# Altium project SVPXFMC_Carrier_6U.PrjPcb (part 5 of 9)

## Sheet DDR4 SDRAM.SchDoc
size A3
Used 2 times, as channels FMC Carrier Channel1/U_DDR4 SDRAM, FMC Carrier Channel2/U_DDR4 SDRAM. Parts and nets are listed once, with the designators drawn on the sheet.
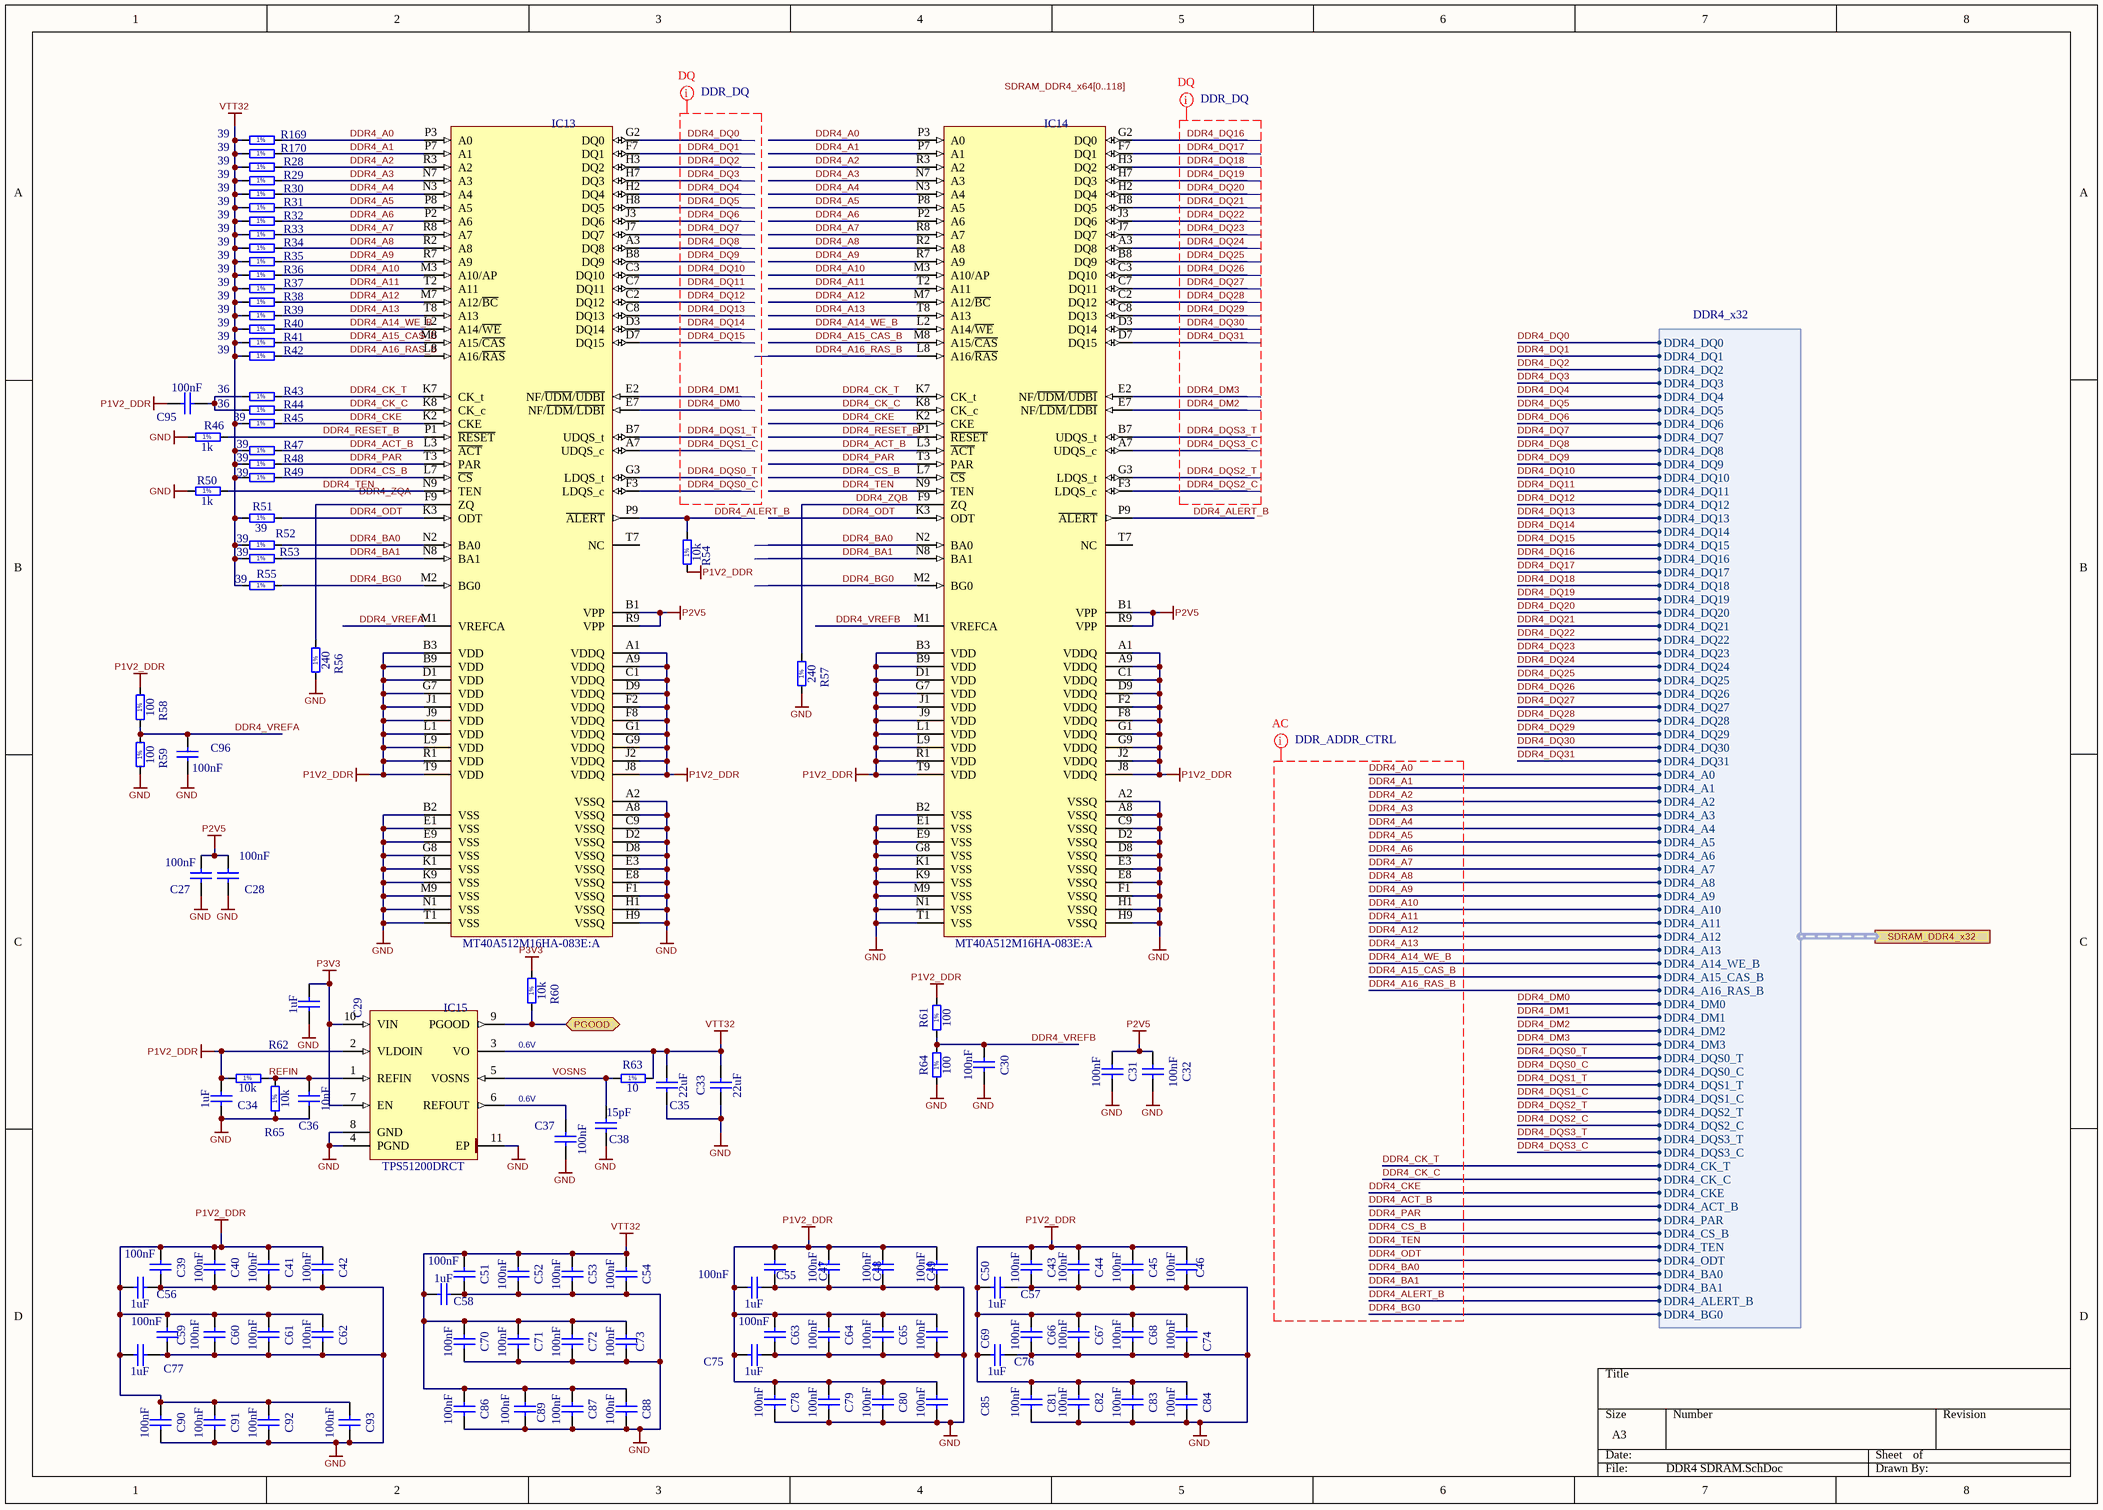
[diagram p13: DDR4 SDRAM.SchDoc]

### Parts
C27  100nF  [CAPC0603X33N]
C28  100nF  [CAPC0603X33N]
C29  1uF  [CAPC1005X55N]
C30  100nF  [CAPC0603X33N]
C31  100nF  [CAPC0603X33N]
C32  100nF  [CAPC0603X33N]
C33  22uF  [CAPC2012X135N]
C34  1uF  [CAPC1005X55N]
C35  22uF  [CAPC2012X135N]
C36  10nF  [CAPC1005X55N]
C37  100nF  [CAPC0603X33N]
C38  15pF  [CAPC1005X55N]
C39  100nF  [CAPC0603X33N]
C40  100nF  [CAPC0603X33N]
C41  100nF  [CAPC0603X33N]
C42  100nF  [CAPC0603X33N]
C43  100nF  [CAPC0603X33N]
C44  100nF  [CAPC0603X33N]
C45  100nF  [CAPC0603X33N]
C46  100nF  [CAPC0603X33N]
C47  100nF  [CAPC0603X33N]
C48  100nF  [CAPC0603X33N]
C49  100nF  [CAPC0603X33N]
C50  100nF  [CAPC0603X33N]
C51  100nF  [CAPC0603X33N]
C52  100nF  [CAPC0603X33N]
C53  100nF  [CAPC0603X33N]
C54  100nF  [CAPC0603X33N]
C55  1uF  [CAPC1005X55N]
C56  1uF  [CAPC1005X55N]
C57  1uF  [CAPC1005X55N]
C58  1uF  [CAPC1005X55N]
C59  100nF  [CAPC0603X33N]
C60  100nF  [CAPC0603X33N]
C61  100nF  [CAPC0603X33N]
C62  100nF  [CAPC0603X33N]
C63  100nF  [CAPC0603X33N]
C64  100nF  [CAPC0603X33N]
C65  100nF  [CAPC0603X33N]
C66  100nF  [CAPC0603X33N]
C67  100nF  [CAPC0603X33N]
C68  100nF  [CAPC0603X33N]
C69  100nF  [CAPC0603X33N]
C70  100nF  [CAPC0603X33N]
C71  100nF  [CAPC0603X33N]
C72  100nF  [CAPC0603X33N]
C73  100nF  [CAPC0603X33N]
C74  100nF  [CAPC0603X33N]
C75  1uF  [CAPC1005X55N]
C76  1uF  [CAPC1005X55N]
C77  1uF  [CAPC1005X55N]
C78  100nF  [CAPC0603X33N]
C79  100nF  [CAPC0603X33N]
C80  100nF  [CAPC0603X33N]
C81  100nF  [CAPC0603X33N]
C82  100nF  [CAPC0603X33N]
C83  100nF  [CAPC0603X33N]
C84  100nF  [CAPC0603X33N]
C85  100nF  [CAPC0603X33N]
C86  100nF  [CAPC0603X33N]
C87  100nF  [CAPC0603X33N]
C88  100nF  [CAPC0603X33N]
C89  100nF  [CAPC0603X33N]
C90  100nF  [CAPC0603X33N]
C91  100nF  [CAPC0603X33N]
C92  100nF  [CAPC0603X33N]
C93  100nF  [CAPC0603X33N]
C95  100nF  [CAPC0603X33N]
C96  100nF  [CAPC0603X33N]
IC13  MT40A512M16HA-083E:A  [BGA96C80P9X16_900X1400X120]
IC14  MT40A512M16HA-083E:A  [BGA96C80P9X16_900X1400X120]
IC15  TPS51200DRCT  [TEXAS_DRC (S-PVSON-N10)]
R28  39  [RESC1005X40N]
R29  39  [RESC1005X40N]
R30  39  [RESC1005X40N]
R31  39  [RESC1005X40N]
R32  39  [RESC1005X40N]
R33  39  [RESC1005X40N]
R34  39  [RESC1005X40N]
R35  39  [RESC1005X40N]
R36  39  [RESC1005X40N]
R37  39  [RESC1005X40N]
R38  39  [RESC1005X40N]
R39  39  [RESC1005X40N]
R40  39  [RESC1005X40N]
R41  39  [RESC1005X40N]
R42  39  [RESC1005X40N]
R43  36  [RESC1005X40N]
R44  36  [RESC1005X40N]
R45  39  [RESC1005X40N]
R46  1k  [RESC1005X40N]
R47  39  [RESC1005X40N]
R48  39  [RESC1005X40N]
R49  39  [RESC1005X40N]
R50  1k  [RESC1005X40N]
R51  39  [RESC1005X40N]
R52  39  [RESC1005X40N]
R53  39  [RESC1005X40N]
R54  10k  [RESC1005X40N]
R55  39  [RESC1005X40N]
R56  240  [RESC1005X40N]
R57  240  [RESC1005X40N]
R58  100  [RESC1005X40N]
R59  100  [RESC1005X40N]
R60  10k  [RESC1005X40N]
R61  100  [RESC1005X40N]
R62  10k  [RESC1005X40N]
R63  10  [RESC1005X40N]
R64  100  [RESC1005X40N]
R65  10k  [RESC1005X40N]
R169  39  [RESC1005X40N]
R170  39  [RESC1005X40N]

### Ports
PGOOD (bidir), SDRAM_DDR4_x32 (harness DDR4_x32)

### Harnesses
DDR4_x32: DDR4_DQ16, DDR4_DQ17, DDR4_DQ18, DDR4_DQ19, DDR4_DQ20, DDR4_DQ21, DDR4_DQ22, DDR4_DQ23, DDR4_DQ24, DDR4_DQ25, DDR4_DQ26, DDR4_DQ27, DDR4_DQ28, DDR4_DQ29, DDR4_DQ30, DDR4_DQ31, DDR4_A0, DDR4_A1, DDR4_A2, DDR4_A3, DDR4_A4, DDR4_A5, DDR4_A6, DDR4_A7, DDR4_A8, DDR4_A9, DDR4_A10, DDR4_A11, DDR4_A12, DDR4_A13, DDR4_A14_WE_B, DDR4_A15_CAS_B, DDR4_A16_RAS_B, DDR4_DM0, DDR4_DM1, DDR4_DM2, DDR4_DM3, DDR4_DQS0_T, DDR4_DQS0_C, DDR4_DQS1_T, DDR4_DQS1_C, DDR4_DQS2_T, DDR4_DQS2_C, DDR4_DQS3_T, DDR4_DQS3_C, DDR4_CK_T, DDR4_CK_C, DDR4_CKE, DDR4_ACT_B, DDR4_PAR, DDR4_CS_B, DDR4_TEN, DDR4_ODT, DDR4_BA0, DDR4_BA1, DDR4_ALERT_B, DDR4_BG0, DDR4_DQ0, DDR4_DQ1, DDR4_DQ2, DDR4_DQ3, DDR4_DQ4, DDR4_DQ5, DDR4_DQ6, DDR4_DQ7, DDR4_DQ8, DDR4_DQ9, DDR4_DQ10, DDR4_DQ11, DDR4_DQ12, DDR4_DQ13, DDR4_DQ14, DDR4_DQ15

### Nets
GND: C27.2 C28.2 C29.2 C30.2 C31.2 C32.2 C33.1 C34.2 C35.1 C36.1 C37.1 C38.1 C39.2 C40.2 C41.2 C42.2 C43.2 C44.2 C45.2 C46.2 C47.2 C48.2 C49.2 C50.2 C51.2 C52.2 C53.2 C54.2 C55.2 C56.2 C57.2 C58.2 C59.2 C60.2 C61.2 C62.2 C63.2 C64.2 C65.2 C66.2 C67.2 C68.2 C69.2 C70.2 C71.2 C72.2 C73.2 C74.2 C75.2 C76.2 C77.2 C78.2 C79.2 C80.2 C81.2 C82.2 C83.2 C84.2 C85.2 C86.2 C87.2 C88.2 C89.2 C90.2 C91.2 C92.2 C93.1 C96.2 IC13.A2(VSSQ) IC13.A8(VSSQ) IC13.B2(VSS) IC13.C9(VSSQ) IC13.D2(VSSQ) IC13.D8(VSSQ) IC13.E1(VSS) IC13.E3(VSSQ) IC13.E8(VSSQ) IC13.E9(VSS) IC13.F1(VSSQ) IC13.G8(VSS) IC13.H1(VSSQ) IC13.H9(VSSQ) IC13.K1(VSS) IC13.K9(VSS) IC13.M9(VSS) IC13.N1(VSS) IC13.T1(VSS) IC14.A2(VSSQ) IC14.A8(VSSQ) IC14.B2(VSS) IC14.C9(VSSQ) IC14.D2(VSSQ) IC14.D8(VSSQ) IC14.E1(VSS) IC14.E3(VSSQ) IC14.E8(VSSQ) IC14.E9(VSS) IC14.F1(VSSQ) IC14.G8(VSS) IC14.H1(VSSQ) IC14.H9(VSSQ) IC14.K1(VSS) IC14.K9(VSS) IC14.M9(VSS) IC14.N1(VSS) IC14.T1(VSS) IC15.4(PGND) IC15.8(GND) IC15.11(EP) R46.1 R50.1 R56.1 R57.1 R59.1 R64.1 R65.1
P1V2_DDR: C34.1 C39.1 C40.1 C41.1 C42.1 C43.1 C44.1 C45.1 C46.1 C47.1 C48.1 C49.1 C50.1 C55.1 C56.1 C57.1 C59.1 C60.1 C61.1 C62.1 C63.1 C64.1 C65.1 C66.1 C67.1 C68.1 C69.1 C74.1 C75.1 C76.1 C77.1 C78.1 C79.1 C80.1 C81.1 C82.1 C83.1 C84.1 C85.1 C90.1 C91.1 C92.1 C93.2 C95.2 IC13.A1(VDDQ) IC13.A9(VDDQ) IC13.B3(VDD) IC13.B9(VDD) IC13.C1(VDDQ) IC13.D1(VDD) IC13.D9(VDDQ) IC13.F2(VDDQ) IC13.F8(VDDQ) IC13.G1(VDDQ) IC13.G7(VDD) IC13.G9(VDDQ) IC13.J1(VDD) IC13.J2(VDDQ) IC13.J8(VDDQ) IC13.J9(VDD) IC13.L1(VDD) IC13.L9(VDD) IC13.R1(VDD) IC13.T9(VDD) IC14.A1(VDDQ) IC14.A9(VDDQ) IC14.B3(VDD) IC14.B9(VDD) IC14.C1(VDDQ) IC14.D1(VDD) IC14.D9(VDDQ) IC14.F2(VDDQ) IC14.F8(VDDQ) IC14.G1(VDDQ) IC14.G7(VDD) IC14.G9(VDDQ) IC14.J1(VDD) IC14.J2(VDDQ) IC14.J8(VDDQ) IC14.J9(VDD) IC14.L1(VDD) IC14.L9(VDD) IC14.R1(VDD) IC14.T9(VDD) IC15.2(VLDOIN) R54.1 R58.2 R61.2 R62.1
P2V5: C27.1 C28.1 C31.1 C32.1 IC13.B1(VPP) IC13.R9(VPP) IC14.B1(VPP) IC14.R9(VPP)
P3V3: C29.1 IC15.7(EN) IC15.10(VIN) R60.2
VTT32: C33.2 C35.2 C51.1 C52.1 C53.1 C54.1 C58.1 C70.1 C71.1 C72.1 C73.1 C86.1 C87.1 C88.1 C89.1 IC15.3(VO) R28.1 R29.1 R30.1 R31.1 R32.1 R33.1 R34.1 R35.1 R36.1 R37.1 R38.1 R39.1 R40.1 R41.1 R42.1 R45.1 R47.1 R48.1 R49.1 R51.1 R52.1 R53.1 R55.1 R63.2 R169.1 R170.1
DDR4_A0: IC13.P3(A0) IC14.P3(A0) R169.2 ; port SDRAM_DDR4_x32.DDR4_A0
DDR4_A1: IC13.P7(A1) IC14.P7(A1) R170.2 ; port SDRAM_DDR4_x32.DDR4_A1
DDR4_A2: IC13.R3(A2) IC14.R3(A2) R28.2 ; port SDRAM_DDR4_x32.DDR4_A2
DDR4_A3: IC13.N7(A3) IC14.N7(A3) R29.2 ; port SDRAM_DDR4_x32.DDR4_A3
DDR4_A4: IC13.N3(A4) IC14.N3(A4) R30.2 ; port SDRAM_DDR4_x32.DDR4_A4
DDR4_A5: IC13.P8(A5) IC14.P8(A5) R31.2 ; port SDRAM_DDR4_x32.DDR4_A5
DDR4_A6: IC13.P2(A6) IC14.P2(A6) R32.2 ; port SDRAM_DDR4_x32.DDR4_A6
DDR4_A7: IC13.R8(A7) IC14.R8(A7) R33.2 ; port SDRAM_DDR4_x32.DDR4_A7
DDR4_A8: IC13.R2(A8) IC14.R2(A8) R34.2 ; port SDRAM_DDR4_x32.DDR4_A8
DDR4_A9: IC13.R7(A9) IC14.R7(A9) R35.2 ; port SDRAM_DDR4_x32.DDR4_A9
DDR4_A10: IC13.M3(A10/AP) IC14.M3(A10/AP) R36.2 ; port SDRAM_DDR4_x32.DDR4_A10
DDR4_A11: IC13.T2(A11) IC14.T2(A11) R37.2 ; port SDRAM_DDR4_x32.DDR4_A11
DDR4_A12: IC13.M7(A12/~{BC}) IC14.M7(A12/~{BC}) R38.2 ; port SDRAM_DDR4_x32.DDR4_A12
DDR4_A13: IC13.T8(A13) IC14.T8(A13) R39.2 ; port SDRAM_DDR4_x32.DDR4_A13
DDR4_A14_WE_B: IC13.L2(A14/~{WE}) IC14.L2(A14/~{WE}) R40.2 ; port SDRAM_DDR4_x32.DDR4_A14_WE_B
DDR4_A15_CAS_B: IC13.M8(A15/~{CAS}) IC14.M8(A15/~{CAS}) R41.2 ; port SDRAM_DDR4_x32.DDR4_A15_CAS_B
DDR4_A16_RAS_B: IC13.L8(A16/~{RAS}) IC14.L8(A16/~{RAS}) R42.2 ; port SDRAM_DDR4_x32.DDR4_A16_RAS_B
DDR4_ACT_B: IC13.L3(~{ACT}) IC14.L3(~{ACT}) R47.2 ; port SDRAM_DDR4_x32.DDR4_ACT_B
DDR4_ALERT_B: IC13.P9(~{ALERT}) IC14.P9(~{ALERT}) R54.2 ; port SDRAM_DDR4_x32.DDR4_ALERT_B
DDR4_BA0: IC13.N2(BA0) IC14.N2(BA0) R52.2 ; port SDRAM_DDR4_x32.DDR4_BA0
DDR4_BA1: IC13.N8(BA1) IC14.N8(BA1) R53.2 ; port SDRAM_DDR4_x32.DDR4_BA1
DDR4_BG0: IC13.M2(BG0) IC14.M2(BG0) R55.2 ; port SDRAM_DDR4_x32.DDR4_BG0
DDR4_CK_C: IC13.K8(CK_c) IC14.K8(CK_c) R44.2 ; port SDRAM_DDR4_x32.DDR4_CK_C
DDR4_CK_T: IC13.K7(CK_t) IC14.K7(CK_t) R43.2 ; port SDRAM_DDR4_x32.DDR4_CK_T
DDR4_CKE: IC13.K2(CKE) IC14.K2(CKE) R45.2 ; port SDRAM_DDR4_x32.DDR4_CKE
DDR4_CS_B: IC13.L7(~{CS}) IC14.L7(~{CS}) R49.2 ; port SDRAM_DDR4_x32.DDR4_CS_B
DDR4_DM0: IC13.E7(NF/~{LDM}/~{LDBI}) ; port SDRAM_DDR4_x32.DDR4_DM0
DDR4_DM1: IC13.E2(NF/~{UDM}/~{UDBI}) ; port SDRAM_DDR4_x32.DDR4_DM1
DDR4_DM2: IC14.E7(NF/~{LDM}/~{LDBI}) ; port SDRAM_DDR4_x32.DDR4_DM2
DDR4_DM3: IC14.E2(NF/~{UDM}/~{UDBI}) ; port SDRAM_DDR4_x32.DDR4_DM3
DDR4_DQ0: IC13.G2(DQ0) ; port SDRAM_DDR4_x32.DDR4_DQ0
DDR4_DQ1: IC13.F7(DQ1) ; port SDRAM_DDR4_x32.DDR4_DQ1
DDR4_DQ2: IC13.H3(DQ2) ; port SDRAM_DDR4_x32.DDR4_DQ2
DDR4_DQ3: IC13.H7(DQ3) ; port SDRAM_DDR4_x32.DDR4_DQ3
DDR4_DQ4: IC13.H2(DQ4) ; port SDRAM_DDR4_x32.DDR4_DQ4
DDR4_DQ5: IC13.H8(DQ5) ; port SDRAM_DDR4_x32.DDR4_DQ5
DDR4_DQ6: IC13.J3(DQ6) ; port SDRAM_DDR4_x32.DDR4_DQ6
DDR4_DQ7: IC13.J7(DQ7) ; port SDRAM_DDR4_x32.DDR4_DQ7
DDR4_DQ8: IC13.A3(DQ8) ; port SDRAM_DDR4_x32.DDR4_DQ8
DDR4_DQ9: IC13.B8(DQ9) ; port SDRAM_DDR4_x32.DDR4_DQ9
DDR4_DQ10: IC13.C3(DQ10) ; port SDRAM_DDR4_x32.DDR4_DQ10
DDR4_DQ11: IC13.C7(DQ11) ; port SDRAM_DDR4_x32.DDR4_DQ11
DDR4_DQ12: IC13.C2(DQ12) ; port SDRAM_DDR4_x32.DDR4_DQ12
DDR4_DQ13: IC13.C8(DQ13) ; port SDRAM_DDR4_x32.DDR4_DQ13
DDR4_DQ14: IC13.D3(DQ14) ; port SDRAM_DDR4_x32.DDR4_DQ14
DDR4_DQ15: IC13.D7(DQ15) ; port SDRAM_DDR4_x32.DDR4_DQ15
DDR4_DQ16: IC14.G2(DQ0) ; port SDRAM_DDR4_x32.DDR4_DQ16
DDR4_DQ17: IC14.F7(DQ1) ; port SDRAM_DDR4_x32.DDR4_DQ17
DDR4_DQ18: IC14.H3(DQ2) ; port SDRAM_DDR4_x32.DDR4_DQ18
DDR4_DQ19: IC14.H7(DQ3) ; port SDRAM_DDR4_x32.DDR4_DQ19
DDR4_DQ20: IC14.H2(DQ4) ; port SDRAM_DDR4_x32.DDR4_DQ20
DDR4_DQ21: IC14.H8(DQ5) ; port SDRAM_DDR4_x32.DDR4_DQ21
DDR4_DQ22: IC14.J3(DQ6) ; port SDRAM_DDR4_x32.DDR4_DQ22
DDR4_DQ23: IC14.J7(DQ7) ; port SDRAM_DDR4_x32.DDR4_DQ23
DDR4_DQ24: IC14.A3(DQ8) ; port SDRAM_DDR4_x32.DDR4_DQ24
DDR4_DQ25: IC14.B8(DQ9) ; port SDRAM_DDR4_x32.DDR4_DQ25
DDR4_DQ26: IC14.C3(DQ10) ; port SDRAM_DDR4_x32.DDR4_DQ26
DDR4_DQ27: IC14.C7(DQ11) ; port SDRAM_DDR4_x32.DDR4_DQ27
DDR4_DQ28: IC14.C2(DQ12) ; port SDRAM_DDR4_x32.DDR4_DQ28
DDR4_DQ29: IC14.C8(DQ13) ; port SDRAM_DDR4_x32.DDR4_DQ29
DDR4_DQ30: IC14.D3(DQ14) ; port SDRAM_DDR4_x32.DDR4_DQ30
DDR4_DQ31: IC14.D7(DQ15) ; port SDRAM_DDR4_x32.DDR4_DQ31
DDR4_DQS0_C: IC13.F3(LDQS_c) ; port SDRAM_DDR4_x32.DDR4_DQS0_C
DDR4_DQS0_T: IC13.G3(LDQS_t) ; port SDRAM_DDR4_x32.DDR4_DQS0_T
DDR4_DQS1_C: IC13.A7(UDQS_c) ; port SDRAM_DDR4_x32.DDR4_DQS1_C
DDR4_DQS1_T: IC13.B7(UDQS_t) ; port SDRAM_DDR4_x32.DDR4_DQS1_T
DDR4_DQS2_C: IC14.F3(LDQS_c) ; port SDRAM_DDR4_x32.DDR4_DQS2_C
DDR4_DQS2_T: IC14.G3(LDQS_t) ; port SDRAM_DDR4_x32.DDR4_DQS2_T
DDR4_DQS3_C: IC14.A7(UDQS_c) ; port SDRAM_DDR4_x32.DDR4_DQS3_C
DDR4_DQS3_T: IC14.B7(UDQS_t) ; port SDRAM_DDR4_x32.DDR4_DQS3_T
DDR4_ODT: IC13.K3(ODT) IC14.K3(ODT) R51.2 ; port SDRAM_DDR4_x32.DDR4_ODT
DDR4_PAR: IC13.T3(PAR) IC14.T3(PAR) R48.2 ; port SDRAM_DDR4_x32.DDR4_PAR
DDR4_RESET_B: IC13.P1(~{RESET}) IC14.P1(~{RESET}) R46.2
DDR4_TEN: IC13.N9(TEN) IC14.N9(TEN) R50.2 ; port SDRAM_DDR4_x32.DDR4_TEN
DDR4_VREFA: C96.1 IC13.M1(VREFCA) R58.1 R59.2
DDR4_VREFB: C30.1 IC14.M1(VREFCA) R61.1 R64.2
DDR4_ZQB: IC14.F9(ZQ) R57.2
PGOOD: IC15.9(PGOOD) R60.1 ; port PGOOD
REFIN: C36.2 IC15.1(REFIN) R62.2 R65.2
VOSNS: C38.2 IC15.5(VOSNS) R63.1
NetC37_2: C37.2 IC15.6(REFOUT)
NetC95_1: C95.1 R43.1 R44.1
NetIC13_F9: IC13.F9(ZQ) R56.2

Not connected (* = marked no-connect by the designer): IC13 T7(NC); IC14 T7(NC)

### Channels
FMC Carrier Channel1/U_DDR4 SDRAM: designators end in A; ports PGOOD=NetIC15A_9
FMC Carrier Channel2/U_DDR4 SDRAM: designators end in B; ports PGOOD=NetIC15B_9

### Buses and harness runs
bus SDRAM_DDR4_x64[0..118]

### Layout directives
net class DDR_DQ: DDR4_DM0, DDR4_DM1, DDR4_DM2, DDR4_DM3, DDR4_DQ0, DDR4_DQ1, DDR4_DQ2, DDR4_DQ3, DDR4_DQ4, DDR4_DQ5, DDR4_DQ6, DDR4_DQ7, DDR4_DQ8, DDR4_DQ9, DDR4_DQ10, DDR4_DQ11, DDR4_DQ12, DDR4_DQ13, DDR4_DQ14, DDR4_DQ15, DDR4_DQ16, DDR4_DQ17, DDR4_DQ18, DDR4_DQ19, DDR4_DQ20, DDR4_DQ21, DDR4_DQ22, DDR4_DQ23, DDR4_DQ24, DDR4_DQ25, DDR4_DQ26, DDR4_DQ27, DDR4_DQ28, DDR4_DQ29, DDR4_DQ30, DDR4_DQ31, DDR4_DQS0_C, DDR4_DQS0_T, DDR4_DQS1_C, DDR4_DQS1_T, DDR4_DQS2_C, DDR4_DQS2_T, DDR4_DQS3_C, DDR4_DQS3_T
net class DDR_ADDR_CTRL: DDR4_A0, DDR4_A1, DDR4_A2, DDR4_A3, DDR4_A4, DDR4_A5, DDR4_A6, DDR4_A7, DDR4_A8, DDR4_A9, DDR4_A10, DDR4_A11, DDR4_A12, DDR4_A13, DDR4_A14_WE_B, DDR4_A15_CAS_B, DDR4_A16_RAS_B, DDR4_ACT_B, DDR4_ALERT_B, DDR4_BA0, DDR4_BA1, DDR4_BG0, DDR4_CK_C, DDR4_CK_T, DDR4_CKE, DDR4_CS_B, DDR4_ODT, DDR4_PAR, DDR4_TEN

### Notes on the sheet
- 0.6V
- Labels drawn without touching a wire or pin: DDR4_ZQA, SDRAM_DDR4_x64[0..118]
- (in symbol R0402_1K_1%_0.0625W_100PPM) 1%
- (in symbol R0402_10K_1%_0.0625W_100PPM) 1%
- (in symbol R0402_10R_1%_0.0625W_200PPM) 1%
- (in symbol R0402_36R_1%_0.0625W_100PPM) 1%
- (in symbol R0402_39R_1%_0.0625W_100PPM) 1%
- (in symbol R0402_100R_1%_0.0625W_100PPM) 1%
- (in symbol R0402_240R_1%_0.0625W_100PPM) 1%

### Library data of the parts
C27 C28 C30-C32 C37 C39-C54 C59-C74 C78-C93 C95 C96 = CC0201_100NF_6.3V_10%_X5R: Non-polarised capacitor; Manufacturer: GENERIC; Part Description: SMD Multilayer Chip Ceramic Capacitor; Manufacturer1 Part Number: 02016D104KAT2A; Tolerance: ±10%; Voltage: 6.3V; TC: X5R; Manufacturer Part Number: CC0201_100NF_6.3V_10%_X5R; Part Number: CC0201_100NF_6.3V_10%_X5R; Value: 100nF; Component Kind: Standard; Component Type: Standard; Pin Count: 2; Status: Not Recommended; Case: 0201; Mounted: Yes; Socket: No; SMD: Yes; Sense: No; Manufacturer1 Example: AVX; Manufacturer1 ComponentHeight: 0.33mm; HelpURL: \\cern.ch\dfs\Applications\Altium\Datasheets\CC0201_X5R_AVX.pdf; Author: CERN DEM JLC; CreateDate: 03/12/2007; LatestRevisionDate: 03/12/2007
C29 C34 C55-C58 C75-C77 = CC0402_1UF_16V_10%_X5R: Non-polarised capacitor; Manufacturer: GENERIC; Part Description: SMD Multilayer Chip Ceramic Capacitor; Manufacturer1 Part Number: C1005X5R1C105KT; Tolerance: ±10%; Voltage: 16V; TC: X5R; Manufacturer Part Number: CC0402_1UF_16V_10%_X5R; Part Number: CC0402_1UF_16V_10%_X5R; Value: 1uF; Component Kind: Standard; Component Type: Standard; Pin Count: 2; Status: Preferred; Case: 0402; Mounted: Yes; Socket: No; SMD: Yes; Sense: No; Manufacturer1 Example: TDK; Manufacturer1 ComponentHeight: 0.55mm; HelpURL: \\cern.ch\dfs\Applications\Altium\Datasheets\CC0402_X5R_TDK_C.pdf; Author: CERN DEM JLC; CreateDate: 25/10/2012; LatestRevisionDate: 25/10/2012
C33 C35 = CC0805_22UF_10V_+80%-20%_Y5V: Non-polarised capacitor; Manufacturer: GENERIC; Part Description: SMD Multilayer Chip Ceramic Capacitor; Manufacturer1 Part Number: 2222 241 19881; Voltage: 10V; TC: Y5V; Manufacturer Part Number: CC0805_22UF_10V_+80%-20%_Y5V; Part Number: CC0805_22UF_10V_+80%-20%_Y5V; Tolerance: +80% -20%; Value: 22uF; Component Kind: Standard; Component Type: Standard; Pin Count: 2; Status: Preferred; Case: 0805; Mounted: Yes; Socket: No; SMD: Yes; Sense: No; Manufacturer1 Example: PHYCOMP; Manufacturer1 ComponentHeight: 1.45mm; HelpURL: \\cern.ch\dfs\Applications\Altium\Datasheets\CC0805_Y5V_PHYCOMP.pdf; Author: CERN DEM JLC; CreateDate: 03/12/2007; LatestRevisionDate: 03/12/2007
C36 = CC0402_10NF_25V_10%_X7R: Non-polarised capacitor; Manufacturer: GENERIC; Part Description: SMD Multilayer Chip Ceramic Capacitor; Manufacturer1 Part Number: C1005X7R1E103KT; Tolerance: ±10%; Voltage: 25V; TC: X7R; Manufacturer Part Number: CC0402_10NF_25V_10%_X7R; Part Number: CC0402_10NF_25V_10%_X7R; Value: 10nF; Component Kind: Standard; Component Type: Standard; Pin Count: 2; Status: Preferred; Case: 0402; Mounted: Yes; Socket: No; SMD: Yes; Sense: No; Manufacturer1 Example: TDK; Manufacturer1 ComponentHeight: 0.55mm; HelpURL: \\cern.ch\dfs\Applications\Altium\Datasheets\CC0402_X7R_TDK_C.pdf; Author: CERN DEM JLC; CreateDate: 25/10/2012; LatestRevisionDate: 25/10/2012
C38 = CC0402_15PF_50V_5%_C0G: Non-polarised capacitor; Manufacturer: GENERIC; Part Description: SMD Multilayer Chip Ceramic Capacitor; Manufacturer1 Part Number: C0402C150J5GACTU; Tolerance: ±5%; Voltage: 50V; TC: C0G/NP0; Manufacturer Part Number: CC0402_15PF_50V_5%_C0G; Part Number: CC0402_15PF_50V_5%_C0G; Value: 15pF; Component Kind: Standard; Component Type: Standard; Pin Count: 2; Status: Preferred; Case: 0402; Mounted: Yes; Socket: No; SMD: Yes; Sense: No; Manufacturer1 Example: KEMET; Manufacturer1 ComponentHeight: 0.55mm; HelpURL: \\cern.ch\dfs\Applications\Altium\Datasheets\CC0805_C0G_KEMET_(Commercial Grade).pdf; Author: CERN DEM JLC; CreateDate: 03/12/2007; LatestRevisionDate: 22/04/2015
IC13 IC14 = MT40A512M16HA-083E:A: +1.2V, 8Gb (512 Meg x 16 x 8 Banks) DDR4 SDRAM; Manufacturer: MICRON TECHNOLOGY; Part Description: +1.2V, 8Gb (512 Meg x 16) DDR4 SDRAM; PressFit: No; Bonding: No; Manufacturer Part Number: MT40A512M16HA-083E:A; PackageDescription: BGA 0.8mm, Pitch, Square 96 Pin, 9 Columns x 16 Rows, Body 14mm X 9mm X 1.2mm H; Part Number: MT40A512M16HA-083E:A; Component Kind: Standard; Component Type: Standard; Device: MT40A512M16HA-083E:A; Pin Count: 96; Case: BGA96; Mounted: Yes; Socket: No; SMD: Yes; Sense: No; ComponentHeight: 1.2mm; HelpURL: \\cern.ch\dfs\Applications\Altium\Datasheets\MT40A512M16HA-083E-A.pdf; Author: CERN DEM MR; CreateDate: 12/02/2016; LatestRevisionDate: 03/06/2016
IC15 = TPS51200DRCT: Sink/Source DDR Termination Regulator; Manufacturer: TEXAS INSTRUMENTS; Part Description: 3.3V Sink/Source DDR Termination Regulator; PressFit: No; Bonding: No; Manufacturer Part Number: TPS51200DRCT; PackageDescription: SON, 0.50mm Pitch, 10-pin, 3.00mm W  X 3.00mm L X 1.00mm Height, (w/thermal tab 1.75 X 2.50 mm); Part Number: TPS51200DRCT; Component Kind: Standard; Component Type: Standard; Device: TPS51200DRCT; Pin Count: 11; Case: SON10; Mounted: Yes; Socket: No; SMD: Yes; Sense: No; ComponentHeight: 1mm; HelpURL: \\cern.ch\dfs\Applications\Altium\Datasheets\TPS51200DRCT.pdf; Author: CERN DEM JLC; CreateDate: 03/02/2010; LatestRevisionDate: 06/11/2013
R28-R42 R45 R47-R49 R51-R53 R55 R169 R170 = R0402_39R_1%_0.0625W_100PPM: Resistor - 1%; Manufacturer: GENERIC; Part Description: General Purpose Thick Film Chip Resistor; Manufacturer1 Part Number: 232270673909L; TC: ±100ppm/°C; PressFit: No; Manufacturer Part Number: R0402_39R_1%_0.0625W_100PPM; Part Number: R0402_39R_1%_0.0625W_100PPM; Tolerance: ±1%; Value: 39; Component Kind: Standard; Component Type: Standard; Pin Count: 2; Status: Not Recommended; Power: 0.0625W; Case: 0402; Mounted: Yes; Sense: No; Socket: No; SMD: Yes; Manufacturer1 Example: YAGEO PHYCOMP; Manufacturer1 ComponentHeight: 0.4mm; HelpURL: \\cern.ch\dfs\Applications\Altium\Datasheets\R0402_Phycomp_RC0402.pdf; Author: CERN DEM JLC; CreateDate: 03/12/2007; LatestRevisionDate: 17/10/2012
R43 R44 = R0402_36R_1%_0.0625W_100PPM: Resistor - 1%; Manufacturer: GENERIC; Part Description: General Purpose Thick Film Chip Resistor; Manufacturer1 Part Number: 232270673609L; TC: ±100ppm/°C; PressFit: No; Manufacturer Part Number: R0402_36R_1%_0.0625W_100PPM; Part Number: R0402_36R_1%_0.0625W_100PPM; Tolerance: ±1%; Value: 36; Component Kind: Standard; Component Type: Standard; Pin Count: 2; Status: Not Recommended; Power: 0.0625W; Case: 0402; Mounted: Yes; Sense: No; Socket: No; SMD: Yes; Manufacturer1 Example: YAGEO PHYCOMP; Manufacturer1 ComponentHeight: 0.4mm; HelpURL: \\cern.ch\dfs\Applications\Altium\Datasheets\R0402_Phycomp_RC0402.pdf; Author: CERN DEM JLC; CreateDate: 03/12/2007; LatestRevisionDate: 17/10/2012
R46 R50 = R0402_1K_1%_0.0625W_100PPM: Resistor - 1%; Manufacturer: GENERIC; Part Description: General Purpose Thick Film Chip Resistor; Manufacturer1 Part Number: 232270671002L; TC: ±100ppm/°C; PressFit: No; Manufacturer Part Number: R0402_1K_1%_0.0625W_100PPM; Part Number: R0402_1K_1%_0.0625W_100PPM; Tolerance: ±1%; Value: 1k; Component Kind: Standard; Component Type: Standard; Pin Count: 2; Status: Not Recommended; Power: 0.0625W; Case: 0402; Mounted: Yes; Sense: No; Socket: No; SMD: Yes; Manufacturer1 Example: YAGEO PHYCOMP; Manufacturer1 ComponentHeight: 0.4mm; HelpURL: \\cern.ch\dfs\Applications\Altium\Datasheets\R0402_Phycomp_RC0402.pdf; Author: CERN DEM JLC; CreateDate: 03/12/2007; LatestRevisionDate: 17/10/2012
R54 R60 R62 R65 = R0402_10K_1%_0.0625W_100PPM: Resistor - 1%; Manufacturer: GENERIC; Part Description: General Purpose Thick Film Chip Resistor; Manufacturer1 Part Number: 232270671003L; TC: ±100ppm/°C; PressFit: No; Manufacturer Part Number: R0402_10K_1%_0.0625W_100PPM; Part Number: R0402_10K_1%_0.0625W_100PPM; Tolerance: ±1%; Value: 10k; Component Kind: Standard; Component Type: Standard; Pin Count: 2; Status: Not Recommended; Power: 0.0625W; Case: 0402; Mounted: Yes; Sense: No; Socket: No; SMD: Yes; Manufacturer1 Example: YAGEO PHYCOMP; Manufacturer1 ComponentHeight: 0.4mm; HelpURL: \\cern.ch\dfs\Applications\Altium\Datasheets\R0402_Phycomp_RC0402.pdf; Author: CERN DEM JLC; CreateDate: 03/12/2007; LatestRevisionDate: 17/10/2012
R56 R57 = R0402_240R_1%_0.0625W_100PPM: Resistor - 1%; Manufacturer: GENERIC; Part Description: General Purpose Thick Film Chip Resistor; Manufacturer1 Part Number: 232270672401L; TC: ±100ppm/°C; PressFit: No; Manufacturer Part Number: R0402_240R_1%_0.0625W_100PPM; Part Number: R0402_240R_1%_0.0625W_100PPM; Tolerance: ±1%; Value: 240; Component Kind: Standard; Component Type: Standard; Pin Count: 2; Status: Not Recommended; Power: 0.0625W; Case: 0402; Mounted: Yes; Sense: No; Socket: No; SMD: Yes; Manufacturer1 Example: YAGEO PHYCOMP; Manufacturer1 ComponentHeight: 0.4mm; HelpURL: \\cern.ch\dfs\Applications\Altium\Datasheets\R0402_Phycomp_RC0402.pdf; Author: CERN DEM JLC; CreateDate: 03/12/2007; LatestRevisionDate: 17/10/2012
R58 R59 R61 R64 = R0402_100R_1%_0.0625W_100PPM: Resistor - 1%; Manufacturer: GENERIC; Part Description: General Purpose Thick Film Chip Resistor; Manufacturer1 Part Number: 232270671001L; TC: ±100ppm/°C; PressFit: No; Manufacturer Part Number: R0402_100R_1%_0.0625W_100PPM; Part Number: R0402_100R_1%_0.0625W_100PPM; Tolerance: ±1%; Value: 100; Component Kind: Standard; Component Type: Standard; Pin Count: 2; Status: Not Recommended; Power: 0.0625W; Case: 0402; Mounted: Yes; Sense: No; Socket: No; SMD: Yes; Manufacturer1 Example: YAGEO PHYCOMP; Manufacturer1 ComponentHeight: 0.4mm; HelpURL: \\cern.ch\dfs\Applications\Altium\Datasheets\R0402_Phycomp_RC0402.pdf; Author: CERN DEM JLC; CreateDate: 03/12/2007; LatestRevisionDate: 17/10/2012
R63 = R0402_10R_1%_0.0625W_200PPM: Resistor - 1%; Manufacturer: GENERIC; Part Description: General Purpose Thick Film Chip Resistor; Manufacturer1 Part Number: 232270671009L; TC: ±200ppm/°C; PressFit: No; Manufacturer Part Number: R0402_10R_1%_0.0625W_200PPM; Part Number: R0402_10R_1%_0.0625W_200PPM; Tolerance: ±1%; Value: 10; Component Kind: Standard; Component Type: Standard; Pin Count: 2; Status: Not Recommended; Power: 0.0625W; Case: 0402; Mounted: Yes; Sense: No; Socket: No; SMD: Yes; Manufacturer1 Example: YAGEO PHYCOMP; Manufacturer1 ComponentHeight: 0.4mm; HelpURL: \\cern.ch\dfs\Applications\Altium\Datasheets\R0402_Phycomp_RC0402.pdf; Author: CERN DEM JLC; CreateDate: 24/06/2009; LatestRevisionDate: 17/10/2012

## Sheet FPGA_Config.SchDoc
size A2
Used 2 times, as channels FMC Carrier Channel1/FPGA config, FMC Carrier Channel2/FPGA config. Parts and nets are listed once, with the designators drawn on the sheet.
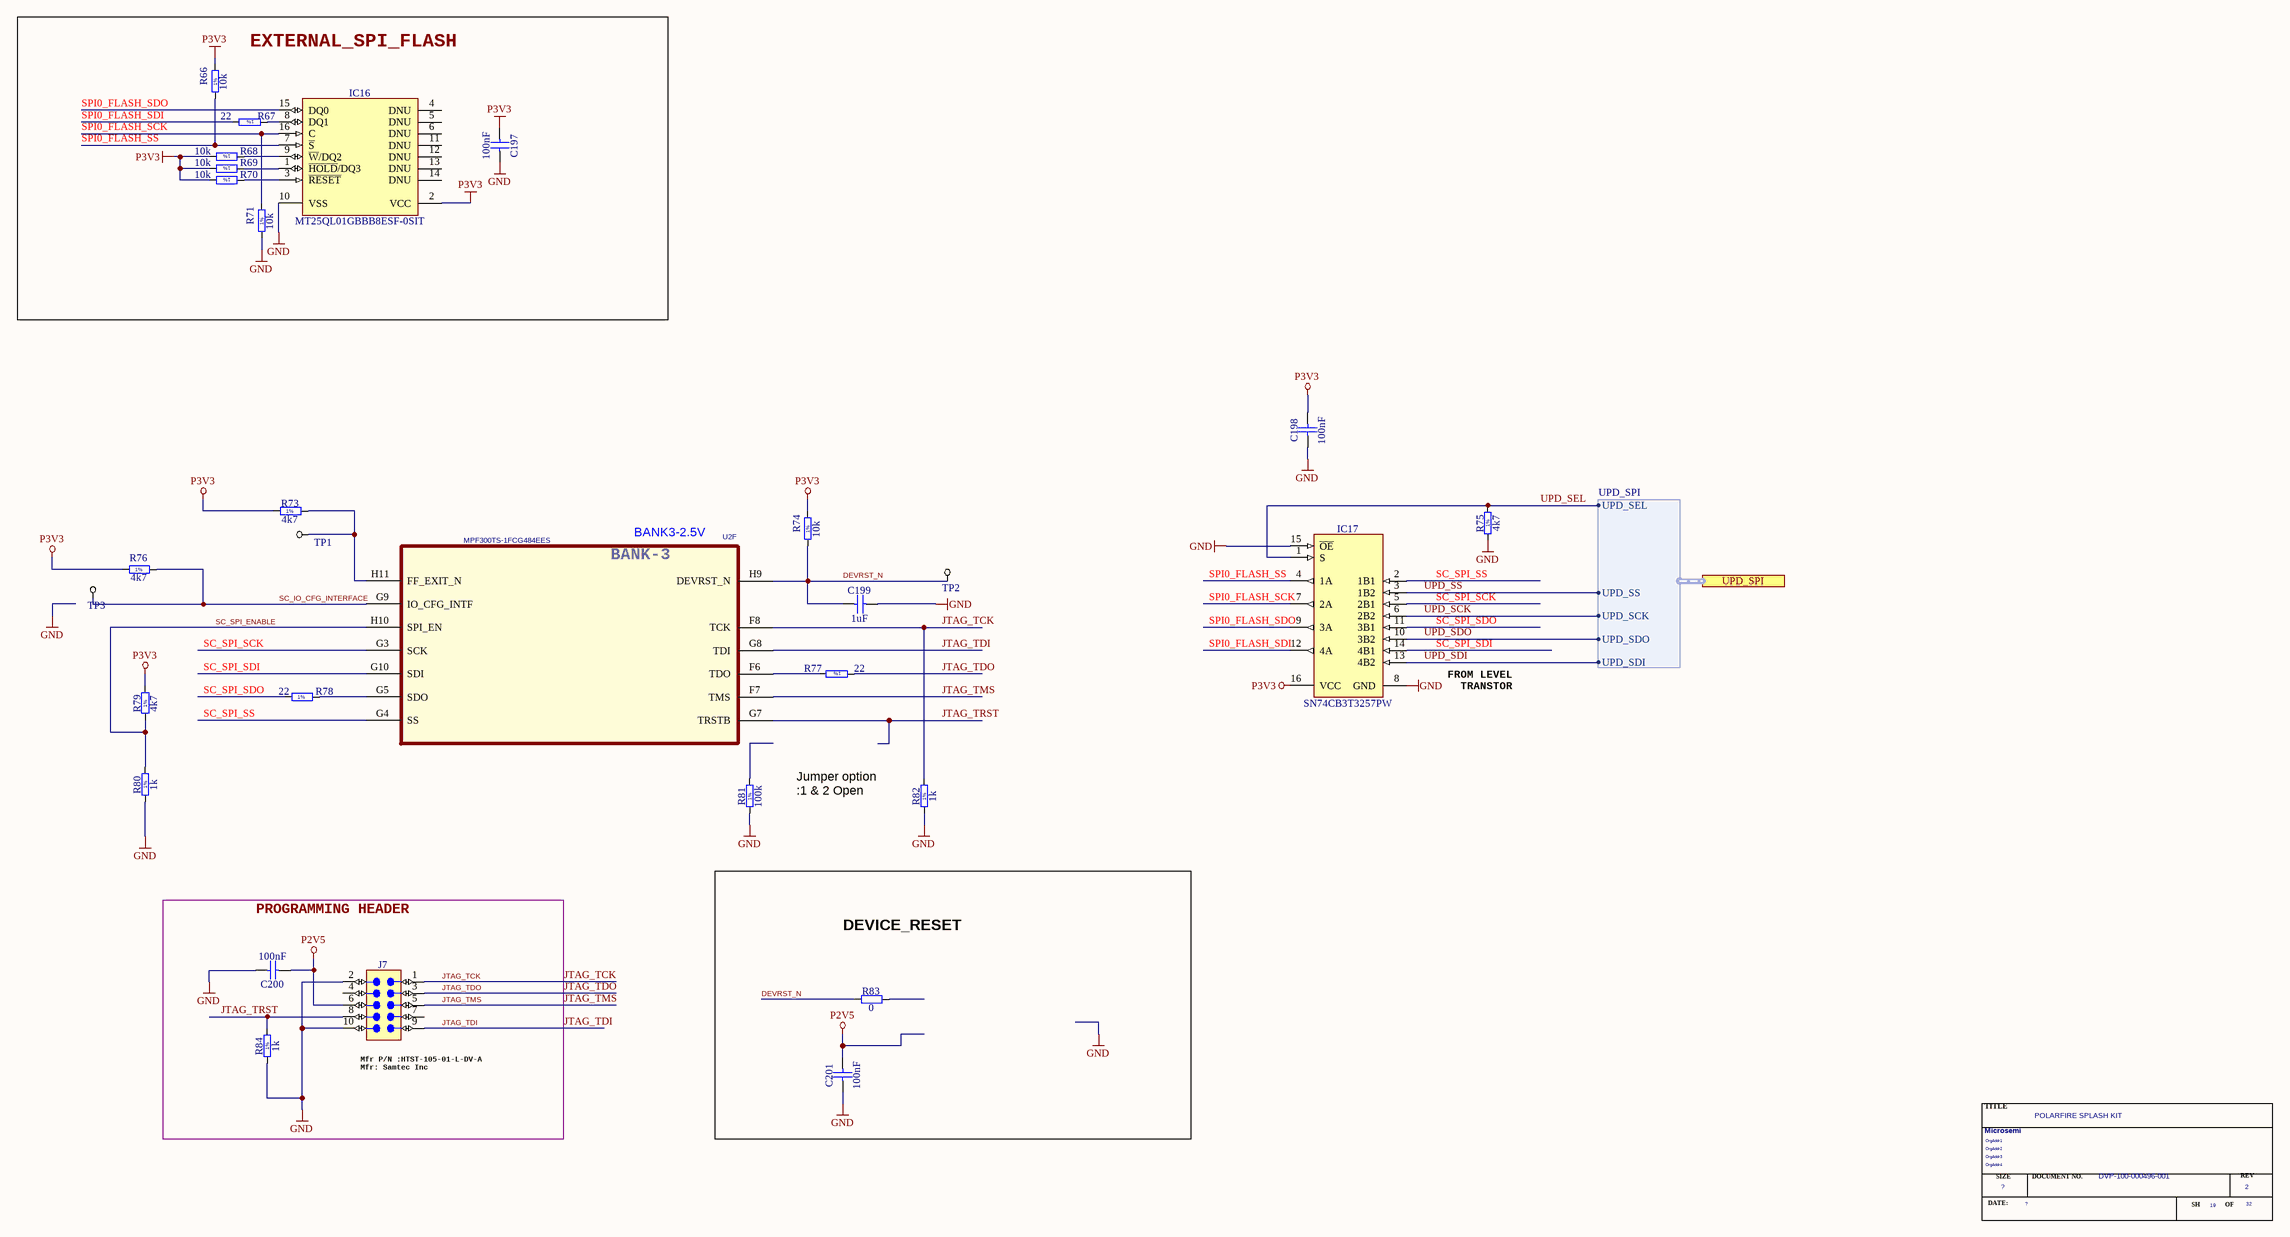
[diagram p14: FPGA_Config.SchDoc]

### Parts
*?  RevCode: 2  Title: POLARFIRE SPLASH KIT  OrgName: Microsemi  Page Number: 19  Page Count: 32  Doc: DVP-100-000496-001  (hidden comment: bayside_blk)  (graphical)
C197  100nF  [CAPC0603X33N]
C198  100nF  [CAPC0603X33N]
C199  1uF  [CAPC1005X55N]
C200  100nF  [CAPC0603X33N]
C201  100nF  [CAPC0603X33N]
IC16  MT25QL01GBBB8ESF-0SIT  [SOIC127P1030X265-16N]
IC17  SN74CB3T3257PW  [SOP65P640X120-16N]
J7  C-Grid®  [MOLEX_70246-1004]  (value not drawn)
R66  10k  [RESC1005X40N]
R67  22  [RESC1005X40N]
R68  10k  [RESC1005X40N]
R69  10k  [RESC1005X40N]
R70  10k  [RESC1005X40N]
R71  10k  [RESC1005X40N]
R73  4k7  [RESC1005X40N]
R74  10k  [RESC1005X40N]
R75  4k7  [RESC1005X40N]
R76  4k7  [RESC1005X40N]
R77  22  [RESC1005X40N]
R78  22  [RESC1005X40N]
R79  4k7  [RESC1005X40N]
R80  1k  [RESC1005X40N]
R81  100k  [RESC1005X40N]
R82  1k  [RESC1005X40N]
R83  0  [RESC1005X40N]
R84  1k  [RESC1005X40N]
TP1  TP  [TP_large]  (value not drawn)
TP2  TP  [TP_large]  (value not drawn)
TP3  TP  [TP_large]  (value not drawn)
U2  MPF300TS-1FCG484EES  [BGA484C100P22X22_2300X2300X320]  (part F of 11)

### Blocks framed on the sheet
EXTERNAL_SPI_FLASH: C197 IC16 R66-R71
DEVICE_RESET: C201 R83
PROGRAMMING HEADER: C200 J7 R84

### Ports
UPD_SPI (harness UPD_SPI)

### Harnesses
UPD_SPI: UPD_SEL, UPD_SS, UPD_SCK, UPD_SDO, UPD_SDI

### Nets
GND: C197.1 C198.1 C199.2 C200.2 C201.1 IC16.10(VSS) IC17.8(GND) IC17.15(~{OE}) J7.2 J7.10 R71.1 R75.1 R80.1 R81.1 R82.1 R84.1
P2V5: C200.1 C201.2 J7.6
P3V3: C197.2 C198.2 IC16.2(VCC) IC17.16(VCC) R66.2 R68.2 R69.2 R70.2 R73.1 R74.2 R76.1 R79.1
DEVRST_N: C199.1 R74.1 R83.1 TP2.1 U2.H9(DEVRST_N)
JTAG_TCK: J7.1 R82.2 U2.F8(TCK)
JTAG_TDI: J7.9 U2.G8(TDI)
JTAG_TDO: J7.3 R77.1
JTAG_TMS: J7.5 U2.F7(TMS)
JTAG_TRST: J7.8 R84.2 U2.G7(TRSTB)
SC_IO_CFG_INTERFACE: R76.2 TP3.1 U2.G9(IO_CFG_INTF)
SC_SPI_ENABLE: R79.2 R80.2 U2.H10(SPI_EN)
SC_SPI_SCK: IC17.5(2B1) U2.G3(SCK)
SC_SPI_SDI: IC17.14(4B1) U2.G10(SDI)
SC_SPI_SDO: IC17.11(3B1) R78.1
SC_SPI_SS: IC17.2(1B1) U2.G4(SS)
SPI0_FLASH_SCK: IC16.16(C) IC17.7(2A) R71.2
SPI0_FLASH_SDI: IC17.12(4A) R67.2
SPI0_FLASH_SDO: IC16.15(DQ0) IC17.9(3A)
SPI0_FLASH_SS: IC16.7(~{S}) IC17.4(1A) R66.1
UPD_SCK: IC17.6(2B2) ; port UPD_SPI.UPD_SCK
UPD_SDI: IC17.13(4B2) ; port UPD_SPI.UPD_SDI
UPD_SDO: IC17.10(3B2) ; port UPD_SPI.UPD_SDO
UPD_SEL: IC17.1(S) R75.2 ; port UPD_SPI.UPD_SEL
UPD_SS: IC17.3(1B2) ; port UPD_SPI.UPD_SS
NetIC16_1: IC16.1(~{HOLD}/DQ3) R69.1
NetIC16_3: IC16.3(~{RESET}) R70.1
NetIC16_8: IC16.8(DQ1) R67.1
NetIC16_9: IC16.9(~{W}/DQ2) R68.1
NetR73_2: R73.2 TP1.1 U2.H11(FF_EXIT_N)
NetR77_2: R77.2 U2.F6(TDO)
NetR78_2: R78.2 U2.G5(SDO)

Not connected (* = marked no-connect by the designer): IC16 4(DNU) 5(DNU) 6(DNU) 11(DNU) 12(DNU) 13(DNU) 14(DNU); J7 4 7; R81 2; R83 2

### Channels
FMC Carrier Channel1/FPGA config: designators *?=*?A C197=C197A C198=C198A C199=C199A C200=C200A C201=C201A IC16=IC16A IC17=IC17A J7=J7A R66=R66A R67=R67A R68=R68A R69=R69A R70=R70A R71=R71A R73=R73A R74=R74A R75=R75A R76=R76A R77=R77A R78=R78A R79=R79A R80=R80A R81=R81A R82=R82A R83=R83A R84=R84A TP1=TP1A TP2=TP2A TP3=TP3A U2=U2A#6
FMC Carrier Channel2/FPGA config: designators *?=*?B C197=C197B C198=C198B C199=C199B C200=C200B C201=C201B IC16=IC16B IC17=IC17B J7=J7B R66=R66B R67=R67B R68=R68B R69=R69B R70=R70B R71=R71B R73=R73B R74=R74B R75=R75B R76=R76B R77=R77B R78=R78B R79=R79B R80=R80B R81=R81B R82=R82B R83=R83B R84=R84B TP1=TP1B TP2=TP2B TP3=TP3B U2=U2B#6

### Notes on the sheet
- (near U2) BANK3-2.5V
- FROM LEVEL
  TRANSTOR
- (near R82) Jumper option
  :1 & 2 Open
- (near J7) Mfr P/N :HTST-105-01-L-DV-A
  Mfr: Samtec Inc
- (in symbol bayside_blk) TITLE; SIZE; DOCUMENT NO.; REV; DATE:; SH; OF
- (in symbol FPGA_MPF300T-FCG484, part F) BANK-3
- (in symbol R0402_1K_1%_0.0625W_100PPM) 1%
- (in symbol R0402_4K7_1%_0.0625W_100PPM) 1%
- (in symbol R0402_10K_1%_0.0625W_100PPM) 1%
- (in symbol R0402_22R_1%_0.0625W_100PPM) 1%
- (in symbol R0402_100K_1%_0.0625W_100PPM) 1%

### Library data of the parts
C197 C200 C201 = CC0201_100NF_6.3V_10%_X5R: Non-polarised capacitor; Manufacturer: GENERIC; Part Description: SMD Multilayer Chip Ceramic Capacitor; Manufacturer1 Part Number: 02016D104KAT2A; Voltage: 6.3V; TC: X5R; Tolerance: ±10%; Part Number: CC0201_100NF_6.3V_10%_X5R; Component Kind: Standard; Component Type: Standard; Pin Count: 2; Value: 100nF; Status: Not Recommended; Manufacturer Part Number: CC0201_100NF_6.3V_10%_X5R; Case: 0201; Mounted: Yes; Socket: No; SMD: Yes; Sense: No; Manufacturer1 Example: AVX; Manufacturer1 ComponentHeight: 0.33mm; HelpURL: \\cern.ch\dfs\Applications\Altium\Datasheets\CC0201_X5R_AVX.pdf; Author: CERN DEM JLC; CreateDate: 03/12/2007; LatestRevisionDate: 03/12/2007
C198 = CC0201_100NF_6.3V_10%_X5R: as C27 on sheet DDR4 SDRAM; Part Number: CC0201_100NF_6.3V_10%_X5R; Component Kind: Standard; Component Type: Standard; Pin Count: 2; Value: 100nF; Status: Not Recommended; Manufacturer Part Number: CC0201_100NF_6.3V_10%_X5R; Case: 0201; Mounted: Yes; Socket: No; SMD: Yes; Sense: No; Manufacturer1 Example: AVX; Manufacturer1 ComponentHeight: 0.33mm; HelpURL: \\cern.ch\dfs\Applications\Altium\Datasheets\CC0201_X5R_AVX.pdf; Author: CERN DEM JLC; CreateDate: 03/12/2007; LatestRevisionDate: 03/12/2007
C199 = CC0402_1UF_16V_10%_X5R: Non-polarised capacitor; Part Description: SMD Multilayer Chip Ceramic Capacitor; Manufacturer: GENERIC; Manufacturer1 Part Number: C1005X5R1C105KT; Voltage: 16V; TC: X5R; Tolerance: ±10%; Part Number: CC0402_1UF_16V_10%_X5R; Component Kind: Standard; Component Type: Standard; Pin Count: 2; Value: 1uF; Status: Preferred; Manufacturer Part Number: CC0402_1UF_16V_10%_X5R; Case: 0402; Mounted: Yes; Socket: No; SMD: Yes; Sense: No; Manufacturer1 Example: TDK; Manufacturer1 ComponentHeight: 0.55mm; HelpURL: \\cern.ch\dfs\Applications\Altium\Datasheets\CC0402_X5R_TDK_C.pdf; Author: CERN DEM JLC; CreateDate: 25/10/2012; LatestRevisionDate: 25/10/2012
IC16 = MEM_MT25QL01GBBB8ESF-0SIT: 1Gbit (128MB), 3.3V, Multiple I/O Serial Flash Memory, Reset# & Hold# Pinset# & Hold# Pins; Manufacturer: MICRON TECHNOLOGY; PressFit: No; Bonding: No; Part Number: MT25QL01GBBB8ESF-0SIT; Component Kind: Standard; Component Type: Standard; Device: MT25QL01GBBB8ESF-0SIT; PackageDescription: SOIC 16, Pitch 1.27mm - Body 7.5x10.3mm, IPC Medium Density; Part Description: 1Gbit (128MB), 3.3V, Multiple I/O Serial Flash Memory, Reset# & Hold# Pins; Manufacturer Part Number: MT25QL01GBBB8ESF-0SIT; Pin Count: 16; Case: SOIC16; Mounted: Yes; Socket: No; SMD: Yes; Sense: No; ComponentHeight: 2.65mm; HelpURL: \\cern.ch\dfs\Applications\Altium\Datasheets\MT25QL01GBBB8ESF-0SIT.pdf; Author: CERN DEM MR; CreateDate: 26/01/2018; LatestRevisionDate: 26/01/2018
IC17 = SN74CB3T3257PW: 4-BIT 1-OF-2 FET Multiplexer/Demultiplexer 2.5V/3.3V Low-Voltage Bus Switch 5V Tolerant Shifter; Manufacturer: TEXAS INSTRUMENTS; PressFit: No; Bonding: No; Part Number: SN74CB3T3257PW; Component Kind: Standard; Component Type: Standard; Device: SN74CB3T3257PW; PackageDescription: SOP, 0.65mm pitch; 16 pin, 4.40mm W X 5.00mm L X 1.20mm H body IPC Medium Density; Part Description: 4-Bit 1-of-2 FET Multiplexer/Demultiplexer 2.5V/3.3V Low-Voltage Bus Switch 5V Tolerant Shifter; Manufacturer Part Number: SN74CB3T3257PW; Pin Count: 16; Case: TSSOP16; Mounted: Yes; Socket: No; SMD: Yes; Sense: No; ComponentHeight: 1.2mm; Author: CERN DEM JLC; HelpURL: \\cern.ch\dfs\Applications\Altium\Datasheets\SN74CB3T3257PW.pdf; CreateDate: 30/01/2012; LatestRevisionDate: 30/01/2012
J7 = MOLEX_70246-1004: Connector 10 Male; Part Description: 2.54mm Pitch C-Grid® Header, Low Profile, Dual Row, Vertical, Shrouded Header; Manufacturer: MOLEX; PressFit: No; Part Number: MOLEX_70246-1004; Component Kind: Standard; Component Type: Standard; Pin Count: 10; Family: C-Grid®; Mounted: Yes; Socket: No; SMD: No; Sense: No; Status: None; Manufacturer Part Number: 70246-1004; ComponentHeight: 9.27mm; HelpURL: \\cern.ch\dfs\Applications\Altium\Datasheets\MOLEX_70246-1004.pdf; Author: CERN DEM JLC; CreateDate: 14/08/2013; LatestRevisionDate: 14/08/2013
R66 R68-R71 R74 = R0402_10K_1%_0.0625W_100PPM: as R54 on sheet DDR4 SDRAM; Manufacturer Part Number: R0402_10K_1%_0.0625W_100PPM; Part Number: R0402_10K_1%_0.0625W_100PPM; Tolerance: ±1%; Value: 10k; Component Kind: Standard; Component Type: Standard; Pin Count: 2; Status: Not Recommended; Power: 0.0625W; Case: 0402; Mounted: Yes; Sense: No; Socket: No; SMD: Yes; Manufacturer1 Example: YAGEO PHYCOMP; Manufacturer1 ComponentHeight: 0.4mm; HelpURL: \\cern.ch\dfs\Applications\Altium\Datasheets\R0402_Phycomp_RC0402.pdf; Author: CERN DEM JLC; CreateDate: 03/12/2007; LatestRevisionDate: 17/10/2012
R67 R77 = R0402_22R_1%_0.0625W_100PPM: Resistor - 1%; Manufacturer: GENERIC; Part Description: General Purpose Thick Film Chip Resistor; Manufacturer1 Part Number: 232270672209L; TC: ±100ppm/°C; PressFit: No; Part Number: R0402_22R_1%_0.0625W_100PPM; Component Kind: Standard; Component Type: Standard; Pin Count: 2; Value: 22; Status: Not Recommended; Power: 0.0625W; Tolerance: ±1%; Manufacturer Part Number: R0402_22R_1%_0.0625W_100PPM; Case: 0402; Mounted: Yes; Sense: No; Socket: No; SMD: Yes; Manufacturer1 Example: YAGEO PHYCOMP; Manufacturer1 ComponentHeight: 0.4mm; HelpURL: \\cern.ch\dfs\Applications\Altium\Datasheets\R0402_Phycomp_RC0402.pdf; Author: CERN DEM JLC; CreateDate: 03/12/2007; LatestRevisionDate: 17/10/2012
R73 R75 R76 R79 = R0402_4K7_1%_0.0625W_100PPM: Resistor - 1%; Manufacturer: GENERIC; Part Description: General Purpose Thick Film Chip Resistor; Manufacturer1 Part Number: 232270674702L; TC: ±100ppm/°C; PressFit: No; Part Number: R0402_4K7_1%_0.0625W_100PPM; Component Kind: Standard; Component Type: Standard; Pin Count: 2; Value: 4k7; Status: Not Recommended; Power: 0.0625W; Tolerance: ±1%; Manufacturer Part Number: R0402_4K7_1%_0.0625W_100PPM; Case: 0402; Mounted: Yes; Sense: No; Socket: No; SMD: Yes; Manufacturer1 Example: YAGEO PHYCOMP; Manufacturer1 ComponentHeight: 0.4mm; HelpURL: \\cern.ch\dfs\Applications\Altium\Datasheets\R0402_Phycomp_RC0402.pdf; Author: CERN DEM JLC; CreateDate: 03/12/2007; LatestRevisionDate: 17/10/2012
R78 = R0402_22R_1%_0.0625W_100PPM: Resistor - 1%; Part Description: General Purpose Thick Film Chip Resistor; Manufacturer: GENERIC; Manufacturer1 Part Number: 232270672209L; TC: ±100ppm/°C; PressFit: No; Part Number: R0402_22R_1%_0.0625W_100PPM; Component Kind: Standard; Component Type: Standard; Pin Count: 2; Value: 22; Status: Not Recommended; Power: 0.0625W; Tolerance: ±1%; Manufacturer Part Number: R0402_22R_1%_0.0625W_100PPM; Case: 0402; Mounted: Yes; Sense: No; Socket: No; SMD: Yes; Manufacturer1 Example: YAGEO PHYCOMP; Manufacturer1 ComponentHeight: 0.4mm; HelpURL: \\cern.ch\dfs\Applications\Altium\Datasheets\R0402_Phycomp_RC0402.pdf; Author: CERN DEM JLC; CreateDate: 03/12/2007; LatestRevisionDate: 17/10/2012
R80 R82 R84 = R0402_1K_1%_0.0625W_100PPM: Resistor - 1%; Part Description: General Purpose Thick Film Chip Resistor; Manufacturer: GENERIC; Manufacturer1 Part Number: 232270671002L; TC: ±100ppm/°C; PressFit: No; Part Number: R0402_1K_1%_0.0625W_100PPM; Component Kind: Standard; Component Type: Standard; Pin Count: 2; Value: 1k; Status: Not Recommended; Power: 0.0625W; Tolerance: ±1%; Manufacturer Part Number: R0402_1K_1%_0.0625W_100PPM; Case: 0402; Mounted: Yes; Sense: No; Socket: No; SMD: Yes; Manufacturer1 Example: YAGEO PHYCOMP; Manufacturer1 ComponentHeight: 0.4mm; HelpURL: \\cern.ch\dfs\Applications\Altium\Datasheets\R0402_Phycomp_RC0402.pdf; Author: CERN DEM JLC; CreateDate: 03/12/2007; LatestRevisionDate: 17/10/2012
R81 = R0402_100K_1%_0.0625W_100PPM: Resistor - 1%; Part Description: General Purpose Thick Film Chip Resistor; Manufacturer: GENERIC; Manufacturer1 Part Number: 232270671004L; TC: ±100ppm/°C; PressFit: No; Part Number: R0402_100K_1%_0.0625W_100PPM; Component Kind: Standard; Component Type: Standard; Pin Count: 2; Value: 100k; Status: Not Recommended; Power: 0.0625W; Tolerance: ±1%; Manufacturer Part Number: R0402_100K_1%_0.0625W_100PPM; Case: 0402; Mounted: Yes; Sense: No; Socket: No; SMD: Yes; Manufacturer1 Example: YAGEO PHYCOMP; Manufacturer1 ComponentHeight: 0.4mm; HelpURL: \\cern.ch\dfs\Applications\Altium\Datasheets\R0402_Phycomp_RC0402.pdf; Author: CERN DEM JLC; CreateDate: 03/12/2007; LatestRevisionDate: 17/10/2012
R83 = R0402_0R_JUMPER: Resistor; Part Description: 1A (0.05R Max DC Resistance) Zero Ohm Jumper; Manufacturer: GENERIC; Manufacturer1 Part Number: 232270591001L; PressFit: No; Part Number: R0402_0R_JUMPER; Component Kind: Standard; Component Type: Standard; Pin Count: 2; Value: 0; Status: Not Recommended; Manufacturer Part Number: R0402_0R_JUMPER; Case: 0402; Mounted: Yes; Sense: No; Socket: No; SMD: Yes; Manufacturer1 Example: YAGEO PHYCOMP; Manufacturer1 ComponentHeight: 0.4mm; HelpURL: \\cern.ch\dfs\Applications\Altium\Datasheets\R0402_Phycomp_RC0402.pdf; Author: CERN DEM JLC; CreateDate: 03/12/2007; LatestRevisionDate: 17/10/2012
TP1-TP3 = TP: Testpoint
U2 = FPGA_MPF300T-FCG484: FCG484,23mmX23mm,1.0mm pitch; Manufacturer: Microsemi; Part Number: MPF300TS-1FCG484I
*? = bayside_blk: OrgAddr4: OrgAddr4; OrgAddr1: OrgAddr1; OrgAddr2: OrgAddr2; OrgAddr3: OrgAddr3; Page Size: ?; Page Modify Date: ?; Project name: POLARFIRE SPLASH KIT

## Sheet Decoupling_caps.SchDoc
size 246 x 182 mm
Used 2 times, as channels FMC Carrier Channel1/U_Decoupling_caps, FMC Carrier Channel2/U_Decoupling_caps. Parts and nets are listed once, with the designators drawn on the sheet.
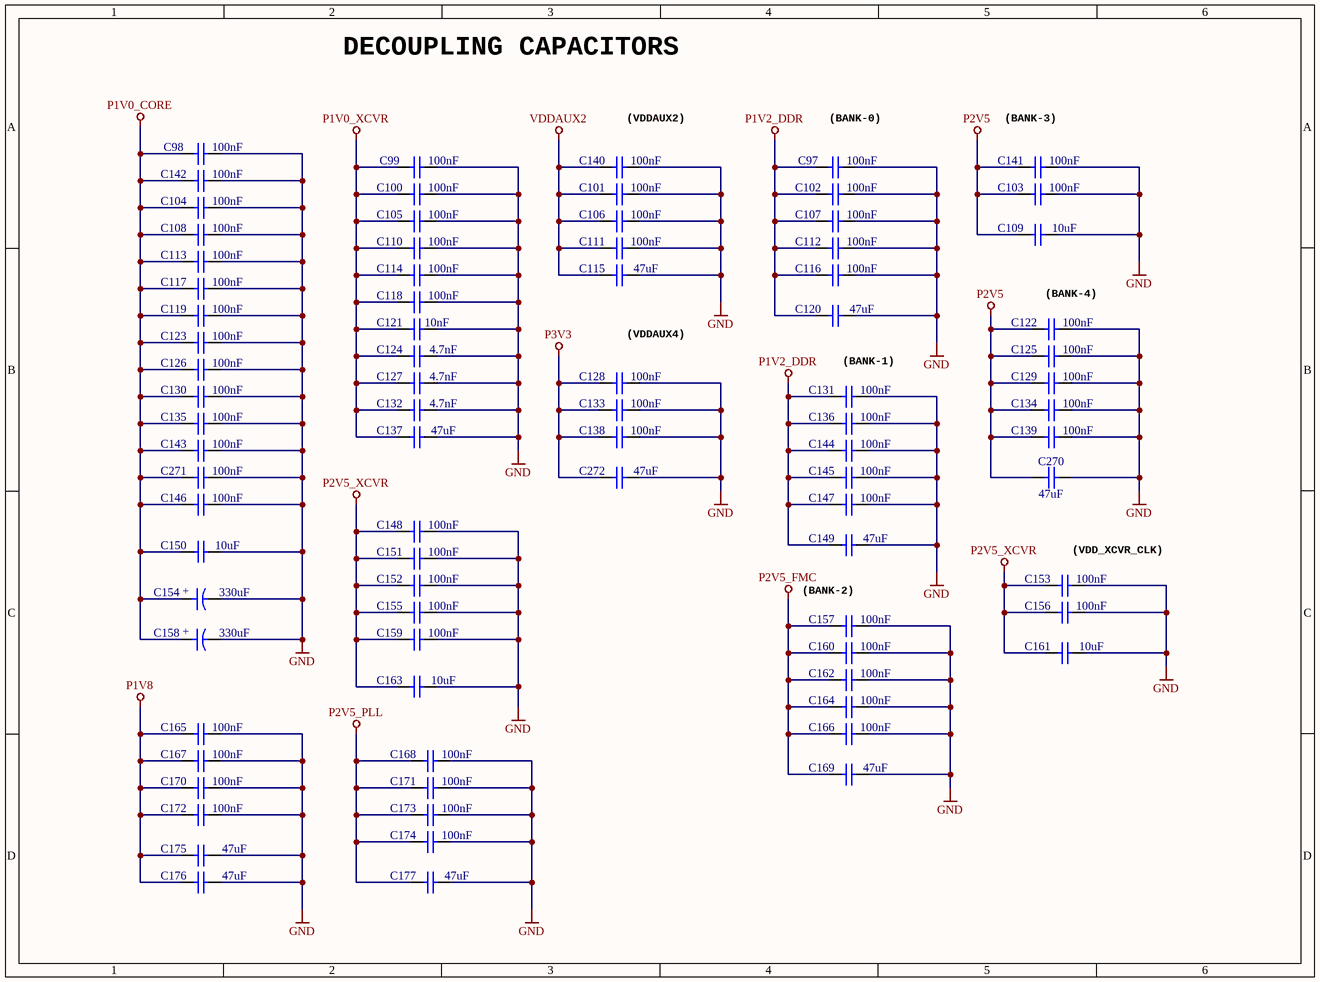
[diagram p15: Decoupling_caps.SchDoc]

### Parts
C97  100nF  [CAPC0603X33N]
C98  100nF  [CAPC0603X33N]
C99  100nF  [CAPC0603X33N]
C100  100nF  [CAPC0603X33N]
C101  100nF  [CAPC0603X33N]
C102  100nF  [CAPC0603X33N]
C103  100nF  [CAPC0603X33N]
C104  100nF  [CAPC0603X33N]
C105  100nF  [CAPC0603X33N]
C106  100nF  [CAPC0603X33N]
C107  100nF  [CAPC0603X33N]
C108  100nF  [CAPC0603X33N]
C109  10uF  [CAPC1608X80N]
C110  100nF  [CAPC0603X33N]
C111  100nF  [CAPC0603X33N]
C112  100nF  [CAPC0603X33N]
C113  100nF  [CAPC0603X33N]
C114  100nF  [CAPC0603X33N]
C115  47uF  [CAPC2012X140N]
C116  100nF  [CAPC0603X33N]
C117  100nF  [CAPC0603X33N]
C118  100nF  [CAPC0603X33N]
C119  100nF  [CAPC0603X33N]
C120  47uF  [CAPC2012X140N]
C121  10nF  [CAPC0603X33N]
C122  100nF  [CAPC0603X33N]
C123  100nF  [CAPC0603X33N]
C124  4.7nF  [CAPC0603X33N]
C125  100nF  [CAPC0603X33N]
C126  100nF  [CAPC0603X33N]
C127  4.7nF  [CAPC0603X33N]
C128  100nF  [CAPC0603X33N]
C129  100nF  [CAPC0603X33N]
C130  100nF  [CAPC0603X33N]
C131  100nF  [CAPC0603X33N]
C132  4.7nF  [CAPC0603X33N]
C133  100nF  [CAPC0603X33N]
C134  100nF  [CAPC0603X33N]
C135  100nF  [CAPC0603X33N]
C136  100nF  [CAPC0603X33N]
C137  47uF  [CAPC2012X140N]
C138  100nF  [CAPC0603X33N]
C139  100nF  [CAPC0603X33N]
C140  100nF  [CAPC0603X33N]
C141  100nF  [CAPC0603X33N]
C142  100nF  [CAPC0603X33N]
C143  100nF  [CAPC0603X33N]
C144  100nF  [CAPC0603X33N]
C145  100nF  [CAPC0603X33N]
C146  100nF  [CAPC0603X33N]
C147  100nF  [CAPC0603X33N]
C148  100nF  [CAPC0603X33N]
C149  47uF  [CAPC2012X140N]
C150  10uF  [CAPC1608X80N]
C151  100nF  [CAPC0603X33N]
C152  100nF  [CAPC0603X33N]
C153  100nF  [CAPC0603X33N]
C154  330uF  [CAPMP7343X310N]
C155  100nF  [CAPC0603X33N]
C156  100nF  [CAPC0603X33N]
C157  100nF  [CAPC0603X33N]
C158  330uF  [CAPMP7343X310N]
C159  100nF  [CAPC0603X33N]
C160  100nF  [CAPC0603X33N]
C161  10uF  [CAPC1608X80N]
C162  100nF  [CAPC0603X33N]
C163  10uF  [CAPC1608X80N]
C164  100nF  [CAPC0603X33N]
C165  100nF  [CAPC0603X33N]
C166  100nF  [CAPC0603X33N]
C167  100nF  [CAPC0603X33N]
C168  100nF  [CAPC0603X33N]
C169  47uF  [CAPC2012X140N]
C170  100nF  [CAPC0603X33N]
C171  100nF  [CAPC0603X33N]
C172  100nF  [CAPC0603X33N]
C173  100nF  [CAPC0603X33N]
C174  100nF  [CAPC0603X33N]
C175  47uF  [CAPC2012X140N]
C176  47uF  [CAPC2012X140N]
C177  47uF  [CAPC2012X140N]
C270  47uF  [CAPC2012X140N]
C271  100nF  [CAPC0603X33N]
C272  47uF  [CAPC2012X140N]

### Nets
GND: C97.2 C98.2 C99.2 C100.2 C101.2 C102.2 C103.2 C104.2 C105.2 C106.2 C107.2 C108.2 C109.2 C110.2 C111.2 C112.2 C113.2 C114.2 C115.2 C116.2 C117.2 C118.2 C119.2 C120.2 C121.2 C122.2 C123.2 C124.2 C125.2 C126.2 C127.2 C128.2 C129.2 C130.2 C131.2 C132.2 C133.2 C134.2 C135.2 C136.2 C137.2 C138.2 C139.2 C140.2 C141.2 C142.2 C143.2 C144.2 C145.2 C146.2 C147.2 C148.2 C149.2 C150.2 C151.2 C152.2 C153.2 C154.2 C155.2 C156.2 C157.2 C158.2 C159.2 C160.2 C161.2 C162.2 C163.2 C164.2 C165.2 C166.2 C167.2 C168.2 C169.2 C170.2 C171.2 C172.2 C173.2 C174.2 C175.2 C176.2 C177.2 C270.2 C271.2 C272.2
P1V0_CORE: C98.1 C104.1 C108.1 C113.1 C117.1 C119.1 C123.1 C126.1 C130.1 C135.1 C142.1 C143.1 C146.1 C150.1 C154.1 C158.1 C271.1
P1V0_XCVR: C99.1 C100.1 C105.1 C110.1 C114.1 C118.1 C121.1 C124.1 C127.1 C132.1 C137.1
P1V2_DDR: C97.1 C102.1 C107.1 C112.1 C116.1 C120.1 C131.1 C136.1 C144.1 C145.1 C147.1 C149.1
P1V8: C165.1 C167.1 C170.1 C172.1 C175.1 C176.1
P2V5: C103.1 C109.1 C122.1 C125.1 C129.1 C134.1 C139.1 C141.1 C270.1
P2V5_FMC: C157.1 C160.1 C162.1 C164.1 C166.1 C169.1
P2V5_PLL: C168.1 C171.1 C173.1 C174.1 C177.1
P2V5_XCVR: C148.1 C151.1 C152.1 C153.1 C155.1 C156.1 C159.1 C161.1 C163.1
P3V3: C128.1 C133.1 C138.1 C272.1
VDDAUX2: C101.1 C106.1 C111.1 C115.1 C140.1

### Channels
FMC Carrier Channel1/U_Decoupling_caps: designators end in A
FMC Carrier Channel2/U_Decoupling_caps: designators end in B

### Notes on the sheet
- DECOUPLING CAPACITORS
- (near C140) (VDDAUX2)
- (near C97) (BANK-0)
- (near C141) (BANK-3)
- (near C122) (BANK-4)
- (VDDAUX4)
- (BANK-1)
- (BANK-2)
- (near C153) (VDD_XCVR_CLK)
- (in symbol CTE7343-31_330UF_6.3V_20%_LESR0025_KEMET_T520) +

### Library data of the parts
C97-C108 C110-C114 C116-C119 C122 C123 C125 C126 C128-C131 C133-C136 C138-C148 C151-C153 C155-C157 C159 C160 C162 C164-C168 C170-C174 C271 = CC0201_100NF_6.3V_10%_X5R: as C197 on sheet FPGA_Config; Part Number: CC0201_100NF_6.3V_10%_X5R; Component Kind: Standard; Component Type: Standard; Pin Count: 2; Value: 100nF; Status: Not Recommended; Manufacturer Part Number: CC0201_100NF_6.3V_10%_X5R; Case: 0201; Mounted: Yes; Socket: No; SMD: Yes; Sense: No; Manufacturer1 Example: AVX; Manufacturer1 ComponentHeight: 0.33mm; HelpURL: \\cern.ch\dfs\Applications\Altium\Datasheets\CC0201_X5R_AVX.pdf; Author: CERN DEM JLC; CreateDate: 03/12/2007; LatestRevisionDate: 03/12/2007
C109 C150 C161 C163 = CC0603_10UF_10V_10%_X5R: Non-polarised capacitor; Manufacturer: GENERIC; Part Description: SMD Multilayer Chip Ceramic Capacitor; Manufacturer1 Part Number: GRM188R61A106KE69D; Voltage: 10V; TC: X5R; Tolerance: ±10%; Part Number: CC0603_10UF_10V_10%_X5R; Component Kind: Standard; Component Type: Standard; Pin Count: 2; Value: 10uF; Status: None; Manufacturer Part Number: CC0603_10UF_10V_10%_X5R; Case: 0603; Mounted: Yes; Socket: No; SMD: Yes; Sense: No; Manufacturer1 Example: MURATA; Manufacturer1 ComponentHeight: 0.8mm; HelpURL: \\cern.ch\dfs\Applications\Altium\Datasheets\CC0603_MURATA_GRM188R61A106KE69D.pdf; Author: CERN DEM JLC; CreateDate: 31/01/2017; LatestRevisionDate: 31/01/2017
C115 C120 C137 C149 C169 C175-C177 C270 C272 = CC0805_47UF_6.3V_20%_X5R: Non-polarised capacitor; Manufacturer: GENERIC; Part Description: SMD Multilayer Chip Ceramic Capacitor; Manufacturer1 Part Number: C0805C476M9PACTU; Voltage: 6.3V; TC: X5R; Tolerance: ±20%; Part Number: CC0805_47UF_6.3V_20%_X5R; Component Kind: Standard; Component Type: Standard; Pin Count: 2; Value: 47uF; Status: Preferred; Manufacturer Part Number: CC0805_47UF_6.3V_20%_X5R; Case: 0805; Mounted: Yes; Socket: No; SMD: Yes; Sense: No; Manufacturer1 Example: KEMET; Manufacturer1 ComponentHeight: 1.4mm; HelpURL: \\cern.ch\dfs\Applications\Altium\Datasheets\CC0805_X5R_KEMET.pdf; Author: CERN DEM JLC; CreateDate: 16/10/2012; LatestRevisionDate: 16/10/2012
C121 = CC0201_10NF_10V_10%_X5R: Non-polarised capacitor; Manufacturer: GENERIC; Part Description: SMD Multilayer Chip Ceramic Capacitor; Manufacturer1 Part Number: 0201ZD103KAT2A; Voltage: 10V; TC: X5R; Tolerance: ±10%; Part Number: CC0201_10NF_10V_10%_X5R; Component Kind: Standard; Component Type: Standard; Pin Count: 2; Value: 10nF; Status: Not Recommended; Manufacturer Part Number: CC0201_10NF_10V_10%_X5R; Case: 0201; Mounted: Yes; Socket: No; SMD: Yes; Sense: No; Manufacturer1 Example: AVX; Manufacturer1 ComponentHeight: 0.33mm; HelpURL: \\cern.ch\dfs\Applications\Altium\Datasheets\CC0201_X5R_AVX.pdf; Author: CERN DEM JLC; CreateDate: 03/12/2007; LatestRevisionDate: 03/12/2007
C124 C127 C132 = CC0201_4.7NF_10V_10%_X5R: Non-polarised capacitor; Manufacturer: GENERIC; Part Description: SMD Multilayer Chip Ceramic Capacitor; Manufacturer1 Part Number: 0201ZD472KAT2A; Voltage: 10V; TC: X5R; Tolerance: ±10%; Part Number: CC0201_4.7NF_10V_10%_X5R; Component Kind: Standard; Component Type: Standard; Pin Count: 2; Value: 4.7nF; Status: Not Recommended; Manufacturer Part Number: CC0201_4.7NF_10V_10%_X5R; Case: 0201; Mounted: Yes; Socket: No; SMD: Yes; Sense: No; Manufacturer1 Example: AVX; Manufacturer1 ComponentHeight: 0.33mm; HelpURL: \\cern.ch\dfs\Applications\Altium\Datasheets\CC0201_X5R_AVX.pdf; Author: CERN DEM JLC; CreateDate: 03/12/2007; LatestRevisionDate: 03/12/2007
C154 C158 = CTE7343-31_330UF_6.3V_20%_LESR0025_KEMET_T520: Polarised capacitor; Manufacturer: KEMET; Part Description: Low ESR 0R025 Tantalum Chip Capacitor; Manufacturer Part Number: T520D337M006ATE025; Voltage: 6.3V; Tolerance: ±20%; Part Number: CTE7343-31_330UF_6.3V_20%_LESR0025_KEMET_T520; Component Kind: Standard; Component Type: Standard; Pin Count: 2; Value: 330uF; Status: None; Case: D; Mounted: Yes; Socket: No; SMD: Yes; Sense: No; ComponentHeight: 3.1mm; HelpURL: \\cern.ch\dfs\Applications\Altium\Datasheets\CTE-LESR_KEMET_T520.pdf; Author: CERN DEM JLC; CreateDate: 20/10/2010; LatestRevisionDate: 20/10/2010